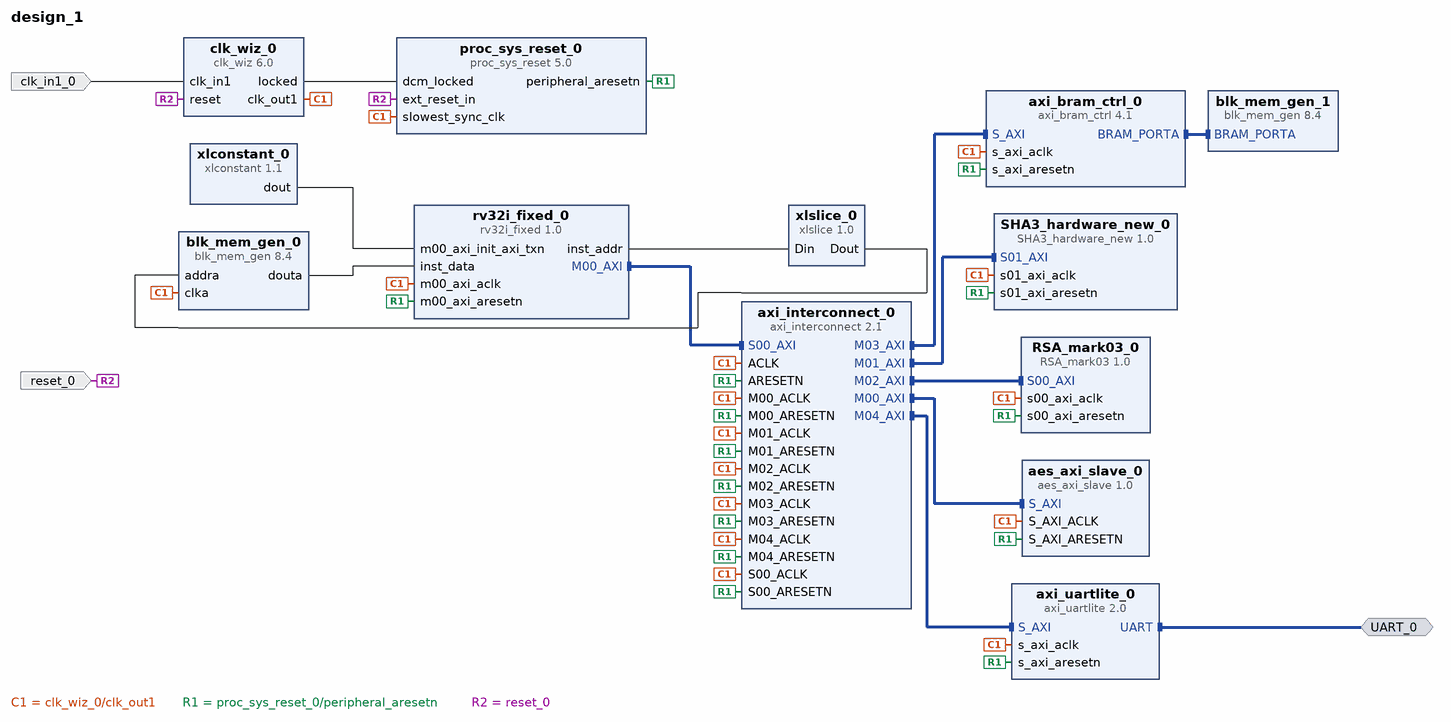
[diagram p0: block diagram of the top level]
# Vivado block design design_1, xc7z020clg484-1, Vivado 2024.2
create_bd_design design_1

create_bd_intf_port -mode Master -vlnv xilinx.com:interface:uart_rtl:1.0 UART_0
create_bd_port -dir I -type rst reset_0
set_property -dict {CONFIG.POLARITY ACTIVE_HIGH} [get_bd_ports reset_0]
create_bd_port -dir I -type clk clk_in1_0

create_bd_cell -type ip -vlnv xilinx.com:ip:axi_interconnect:2.1 axi_interconnect_0
set_property -dict {CONFIG.NUM_MI 5} [get_bd_cells axi_interconnect_0]
create_bd_cell -type ip -vlnv xilinx.com:user:aes_axi_slave:1.0 aes_axi_slave_0
create_bd_cell -type ip -vlnv xilinx.com:user:SHA3_hardware_new:1.0 SHA3_hardware_new_0
create_bd_cell -type ip -vlnv xilinx.com:user:RSA_mark03:1.0 RSA_mark03_0
create_bd_cell -type ip -vlnv xilinx.com:ip:axi_bram_ctrl:4.1 axi_bram_ctrl_0
set_property -dict {CONFIG.SINGLE_PORT_BRAM 1} [get_bd_cells axi_bram_ctrl_0]
create_bd_cell -type ip -vlnv xilinx.com:ip:blk_mem_gen:8.4 blk_mem_gen_0
set_property -dict [list \
  CONFIG.Coe_File ../../../../../../../../firmware_testbench/SE-RISSP_FULL/rsa2048.coe \
  CONFIG.Enable_A Always_Enabled \
  CONFIG.Load_Init_File true \
  CONFIG.Memory_Type Single_Port_ROM \
  CONFIG.Register_PortA_Output_of_Memory_Primitives false \
  CONFIG.use_bram_block Stand_Alone \
] [get_bd_cells blk_mem_gen_0]
create_bd_cell -type ip -vlnv xilinx.com:ip:blk_mem_gen:8.4 blk_mem_gen_1
create_bd_cell -type ip -vlnv xilinx.com:ip:axi_uartlite:2.0 axi_uartlite_0
create_bd_cell -type ip -vlnv xilinx.com:ip:xlslice:1.0 xlslice_0
set_property -dict {CONFIG.DIN_FROM 14 CONFIG.DIN_TO 2 CONFIG.DOUT_WIDTH 13} [get_bd_cells xlslice_0]
create_bd_cell -type ip -vlnv xilinx.com:ip:xlconstant:1.1 xlconstant_0
create_bd_cell -type ip -vlnv xilinx.com:ip:clk_wiz:6.0 clk_wiz_0
set_property -dict [list \
  CONFIG.CLKOUT1_JITTER 159.371 \
  CONFIG.CLKOUT1_REQUESTED_OUT_FREQ 40.000 \
  CONFIG.MMCM_CLKOUT0_DIVIDE_F 25.000 \
] [get_bd_cells clk_wiz_0]
create_bd_cell -type ip -vlnv xilinx.com:ip:proc_sys_reset:5.0 proc_sys_reset_0
create_bd_cell -type ip -vlnv xilinx.com:user:rv32i_fixed:1.0 rv32i_fixed_0

# ---- connections ----

connect_bd_intf_net [get_bd_intf_pins axi_bram_ctrl_0/BRAM_PORTA] [get_bd_intf_pins blk_mem_gen_1/BRAM_PORTA]
connect_bd_intf_net [get_bd_intf_pins aes_axi_slave_0/S_AXI] [get_bd_intf_pins axi_interconnect_0/M00_AXI]
connect_bd_intf_net [get_bd_intf_pins SHA3_hardware_new_0/S01_AXI] [get_bd_intf_pins axi_interconnect_0/M01_AXI]
connect_bd_intf_net [get_bd_intf_pins RSA_mark03_0/S00_AXI] [get_bd_intf_pins axi_interconnect_0/M02_AXI]
connect_bd_intf_net [get_bd_intf_pins axi_bram_ctrl_0/S_AXI] [get_bd_intf_pins axi_interconnect_0/M03_AXI]
connect_bd_intf_net [get_bd_intf_pins axi_interconnect_0/M04_AXI] [get_bd_intf_pins axi_uartlite_0/S_AXI]
connect_bd_intf_net [get_bd_intf_ports UART_0] [get_bd_intf_pins axi_uartlite_0/UART]
connect_bd_intf_net [get_bd_intf_pins rv32i_fixed_0/M00_AXI] [get_bd_intf_pins axi_interconnect_0/S00_AXI]
connect_bd_net [get_bd_pins blk_mem_gen_0/douta] [get_bd_pins rv32i_fixed_0/inst_data]
connect_bd_net -net clk_in1_0_1 [get_bd_ports clk_in1_0] [get_bd_pins clk_wiz_0/clk_in1]
connect_bd_net [get_bd_pins clk_wiz_0/clk_out1] \
  [get_bd_pins blk_mem_gen_0/clka] [get_bd_pins axi_interconnect_0/ACLK] [get_bd_pins axi_interconnect_0/S00_ACLK] \
  [get_bd_pins axi_interconnect_0/M00_ACLK] [get_bd_pins axi_interconnect_0/M01_ACLK] \
  [get_bd_pins axi_interconnect_0/M02_ACLK] [get_bd_pins axi_interconnect_0/M03_ACLK] \
  [get_bd_pins axi_interconnect_0/M04_ACLK] [get_bd_pins SHA3_hardware_new_0/s01_axi_aclk] \
  [get_bd_pins axi_bram_ctrl_0/s_axi_aclk] [get_bd_pins axi_uartlite_0/s_axi_aclk] [get_bd_pins aes_axi_slave_0/S_AXI_ACLK] \
  [get_bd_pins proc_sys_reset_0/slowest_sync_clk] [get_bd_pins RSA_mark03_0/s00_axi_aclk] \
  [get_bd_pins rv32i_fixed_0/m00_axi_aclk]
connect_bd_net [get_bd_pins clk_wiz_0/locked] [get_bd_pins proc_sys_reset_0/dcm_locked]
connect_bd_net [get_bd_pins proc_sys_reset_0/peripheral_aresetn] \
  [get_bd_pins axi_interconnect_0/ARESETN] [get_bd_pins axi_interconnect_0/S00_ARESETN] \
  [get_bd_pins axi_interconnect_0/M00_ARESETN] [get_bd_pins axi_interconnect_0/M01_ARESETN] \
  [get_bd_pins axi_interconnect_0/M02_ARESETN] [get_bd_pins axi_interconnect_0/M03_ARESETN] \
  [get_bd_pins axi_interconnect_0/M04_ARESETN] [get_bd_pins SHA3_hardware_new_0/s01_axi_aresetn] \
  [get_bd_pins axi_bram_ctrl_0/s_axi_aresetn] [get_bd_pins axi_uartlite_0/s_axi_aresetn] \
  [get_bd_pins aes_axi_slave_0/S_AXI_ARESETN] [get_bd_pins RSA_mark03_0/s00_axi_aresetn] \
  [get_bd_pins rv32i_fixed_0/m00_axi_aresetn]
connect_bd_net -net reset_0_1 [get_bd_ports reset_0] [get_bd_pins clk_wiz_0/reset] [get_bd_pins proc_sys_reset_0/ext_reset_in]
connect_bd_net [get_bd_pins rv32i_fixed_0/inst_addr] [get_bd_pins xlslice_0/Din]
connect_bd_net [get_bd_pins xlconstant_0/dout] [get_bd_pins rv32i_fixed_0/m00_axi_init_axi_txn]
connect_bd_net [get_bd_pins xlslice_0/Dout] [get_bd_pins blk_mem_gen_0/addra]

# ---- address map ----
assign_bd_address -offset 0x40000000 -range 64K -target_address_space [get_bd_addr_spaces rv32i_fixed_0/M00_AXI] [get_bd_addr_segs aes_axi_slave_0/S_AXI/reg0]
assign_bd_address -offset 0x40600000 -range 64K -target_address_space [get_bd_addr_spaces rv32i_fixed_0/M00_AXI] [get_bd_addr_segs axi_uartlite_0/S_AXI/Reg]
assign_bd_address -offset 0x44000000 -range 64K -target_address_space [get_bd_addr_spaces rv32i_fixed_0/M00_AXI] [get_bd_addr_segs SHA3_hardware_new_0/S01_AXI/S01_AXI_reg]
assign_bd_address -offset 0x48000000 -range 64K -target_address_space [get_bd_addr_spaces rv32i_fixed_0/M00_AXI] [get_bd_addr_segs RSA_mark03_0/S00_AXI/S00_AXI_reg]
assign_bd_address -offset 0xC0000000 -range 8K -target_address_space [get_bd_addr_spaces rv32i_fixed_0/M00_AXI] [get_bd_addr_segs axi_bram_ctrl_0/S_AXI/Mem0]

validate_bd_design
save_bd_design
